# EAGLE design MotorDriver_FourthEdition_prot (EAGLE 6.6.0)
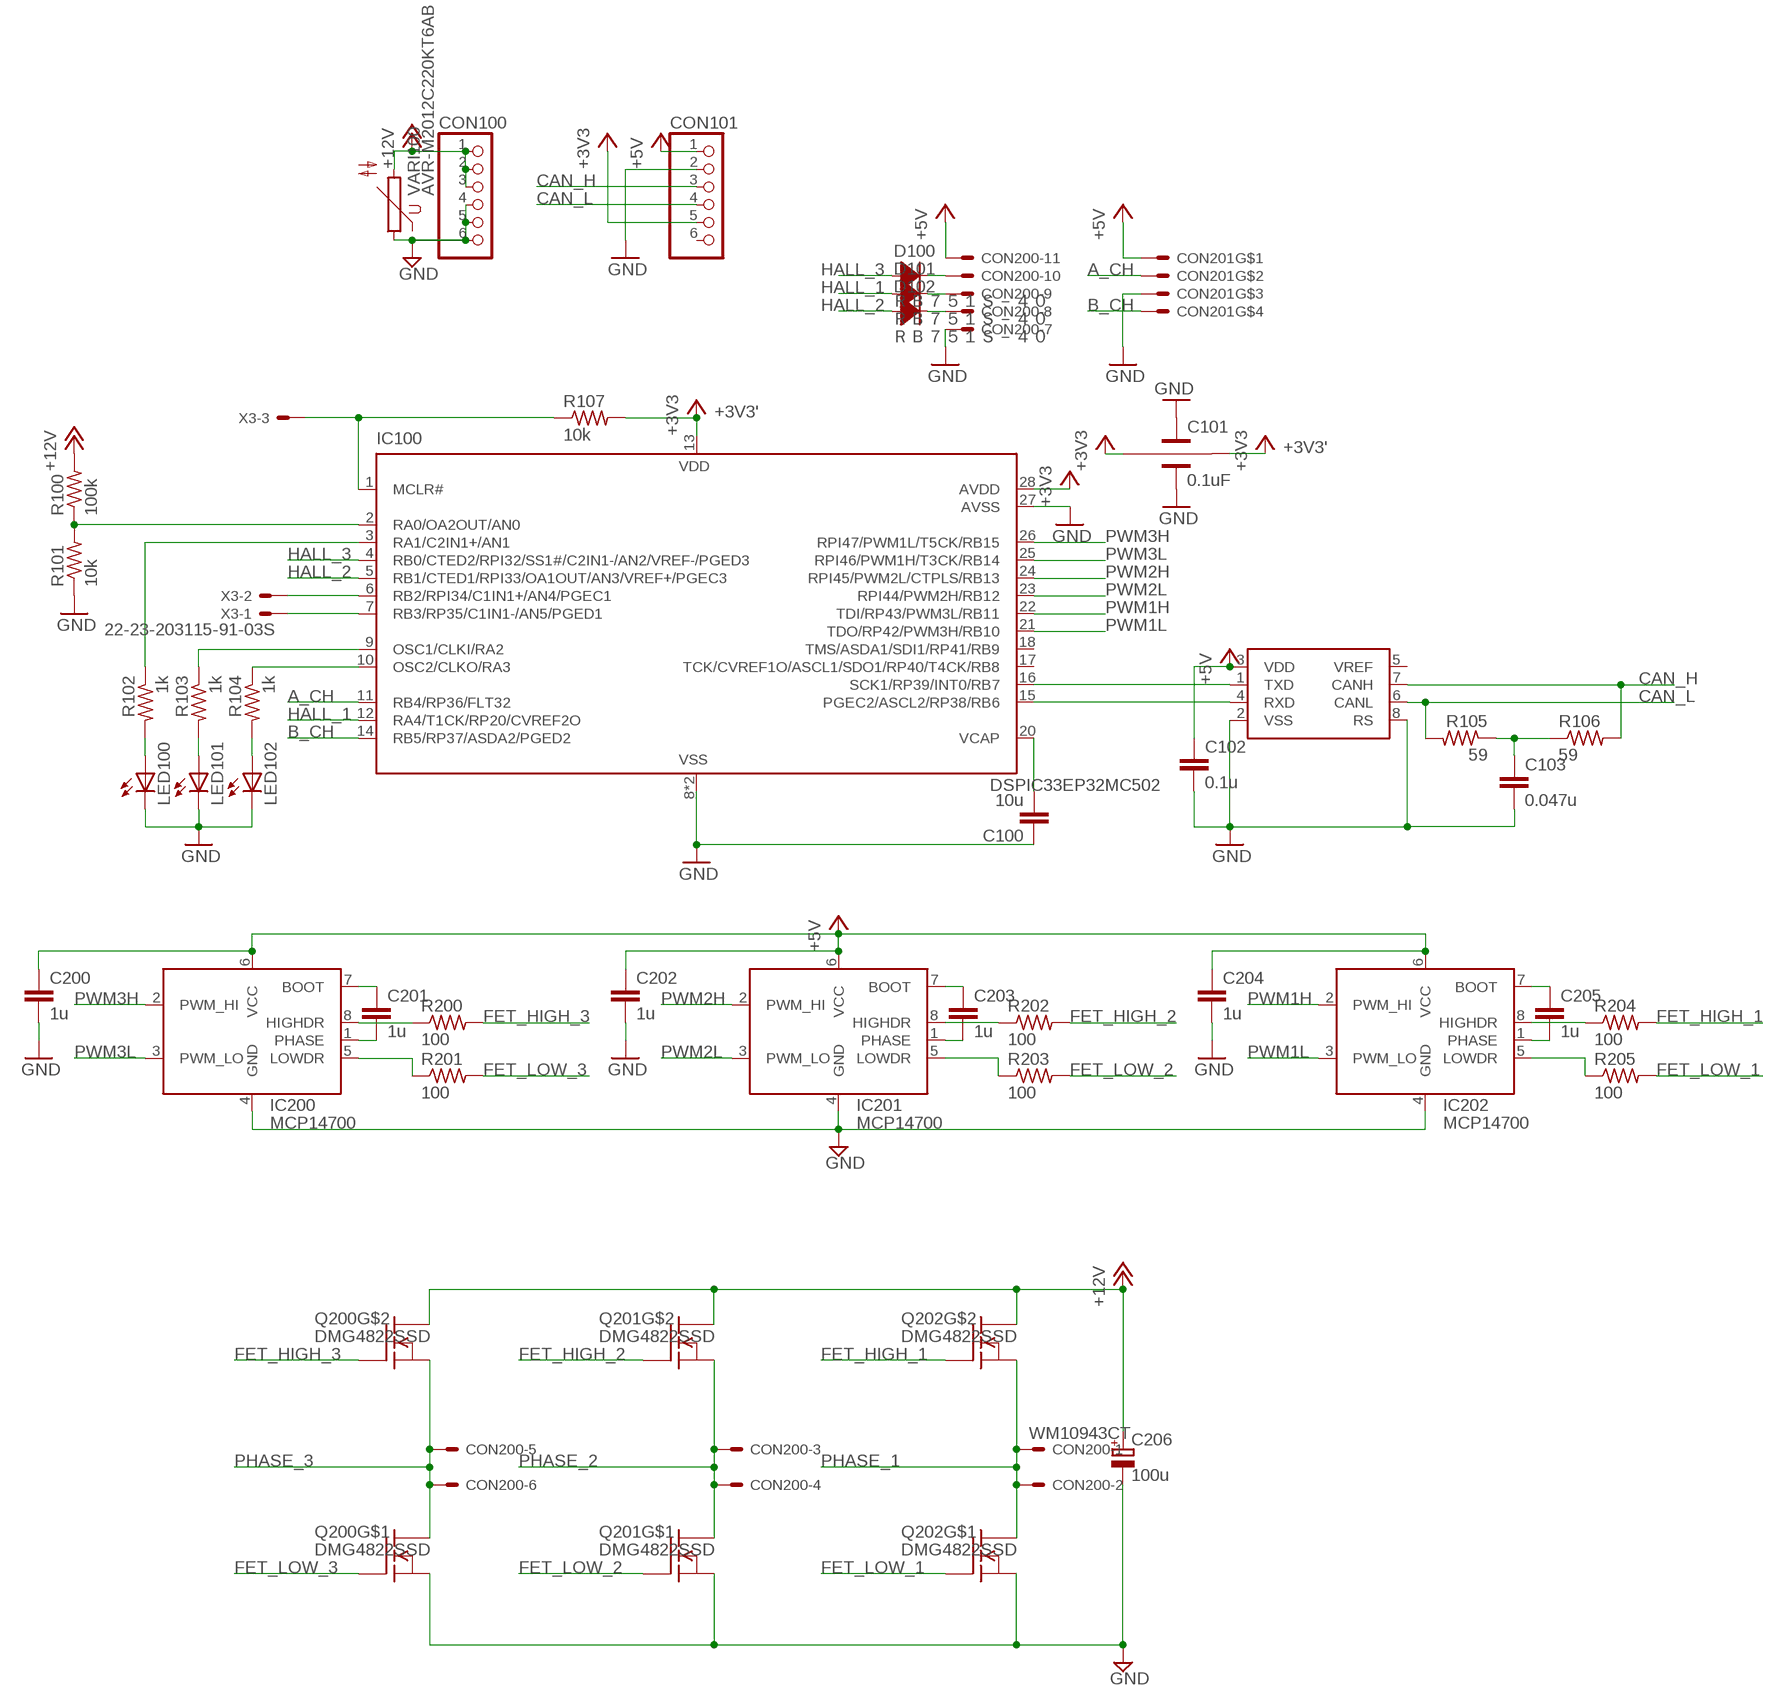
[diagram p0: schematic, sheet 1]

## Parts
C100  10u  CC2012  [C2012]
C101  0.1uF  CKD610JB  [CKD610JB]
C102  0.1u  CC1608  [C1608]
C103  0.047u  CC1608  [C1608]
C200  1u  CC1608  [C1608]
C201  1u  CC1608  [C1608]
C202  1u  CC1608  [C1608]
C203  1u  CC1608  [C1608]
C204  1u  CC1608  [C1608]
C205  1u  CC1608  [C1608]
C206  100u  CPOLE15-5RS  [E15-5RS]
CON100  PINHD-1X6S  [1X06S]
CON101  PINHD-1X6S  [1X06S]
CON200  WM10943CT  52207-1185  [52207-1185]
CON201  4B-XH-AS4B  [S4B-XH-A]
D100  ＲＢ７５１Ｓ－４０  DIODE1SS405  [1608]
D101  ＲＢ７５１Ｓ－４０  DIODE1SS405  [1608]
D102  ＲＢ７５１Ｓ－４０  DIODE1SS405  [1608]
IC100  DSPIC33EP32MC502  [SOIC-28]
IC101  MCP2551  [SOIC-8]
IC200  MCP14700  [SOIC-8]
IC201  MCP14700  [SOIC-8]
IC202  MCP14700  [SOIC-8]
LED100  LEDCHIPLED_0805  [CHIPLED_0805]
LED101  LEDCHIPLED_0805  [CHIPLED_0805]
LED102  LEDCHIPLED_0805  [CHIPLED_0805]
Q200  DMG4822SSD  [SO-8]
Q201  DMG4822SSD  [SO-8]
Q202  DMG4822SSD  [SO-8]
R100  100k  R-US_R1608  [R1608]
R101  10k  R-US_R1608  [R1608]
R102  1k  R-US_R1608  [R1608]
R103  1k  R-US_R1608  [R1608]
R104  1k  R-US_R1608  [R1608]
R105  59  R-US_R1608  [R1608]
R106  59  R-US_R1608  [R1608]
R107  10k  R-US_R1608  [R1608]
R200  100  R-US_R1608  [R1608]
R201  100  R-US_R1608  [R1608]
R202  100  R-US_R1608  [R1608]
R203  100  R-US_R1608  [R1608]
R204  100  R-US_R1608  [R1608]
R205  100  R-US_R1608  [R1608]
VARI100  AVR-M2012C220KT6AB  VARISTOR  [CT/CN0603]
X3  22-23-203115-91-03S  [15-91-03S]

## Nets
+3V3: C101.2(IN) CON101.5
+3V3': C101.1(OUT) IC100.13(VDD) IC100.28(AVDD) R107.2 ; supply symbol labelled +3V3
+5V: C102.1 C200.1 C202.1 C204.1 CON101.1 CON200.11 CON201.1 IC101.3(VDD) IC200.6(VCC) IC201.6(VCC) IC202.6(VCC)
+12V: C206.+ CON100.1 CON100.2 CON100.3 Q200.7(D) Q200.8(D) Q201.7(D) Q201.8(D) Q202.7(D) Q202.8(D) R100.2 VARI100.2
A_CH: CON201.2 IC100.11(RB4/RP36/FLT32)
AGND: C100.1 C101.3(GND) C101.4(GND1) C102.2 C103.2 CON101.2 CON200.7 CON201.3 IC100.8(VSS) IC100.19(VSS) IC100.27(AVSS) IC101.2(VSS) IC101.8(RS) LED100.C LED101.C LED102.C R101.1 ; supply symbol labelled GND
B_CH: CON201.4 IC100.14(RB5/RP37/ASDA2/PGED2)
CAN_H: CON101.3 IC101.7(CANH) R106.2
CAN_L: CON101.4 IC101.6(CANL) R105.2
FET_HIGH_1: Q202.2(G) R204.2
FET_HIGH_2: Q201.2(G) R202.2
FET_HIGH_3: Q200.2(G) R200.2
FET_LOW_1: Q202.4(G) R205.2
FET_LOW_2: Q201.4(G) R203.2
FET_LOW_3: Q200.4(G) R201.2
HALL_1: D101.A IC100.12(RA4/T1CK/RP20/CVREF2O)
HALL_2: D102.A IC100.5(RB1/CTED1/RPI33/OA1OUT/AN3/VREF+/PGEC3)
HALL_3: D100.A IC100.4(RB0/CTED2/RPI32/SS1#/C2IN1-/AN2/VREF-/PGED3)
N$1: IC100.1(MCLR#) R107.1 X3.3
N$2: C201.1 IC200.7(BOOT)
N$3: IC100.3(RA1/C2IN1+/AN1) R102.1
N$4: C203.1 IC201.7(BOOT)
N$5: IC100.7(RB3/RP35/C1IN1-/AN5/PGED1) X3.1
N$6: IC100.2(RA0/OA2OUT/AN0) R100.1 R101.2
N$7: C205.1 IC202.7(BOOT)
N$8: IC100.6(RB2/RPI34/C1IN1+/AN4/PGEC1) X3.2
N$9: C103.1 R105.1 R106.1
N$10: CON200.10 D100.C
N$11: CON200.9 D101.C
N$12: CON200.8 D102.C
N$13: IC100.16(SCK1/RP39/INT0/RB7) IC101.1(TXD)
N$14: IC100.15(PGEC2/ASCL2/RP38/RB6) IC101.4(RXD)
N$15: IC200.8(HIGHDR) R200.1
N$16: IC200.5(LOWDR) R201.1
N$17: IC201.8(HIGHDR) R202.1
N$18: IC201.5(LOWDR) R203.1
N$19: IC100.9(OSC1/CLKI/RA2) R103.1
N$20: LED100.A R102.2
N$21: IC202.8(HIGHDR) R204.1
N$22: IC202.5(LOWDR) R205.1
N$23: IC100.10(OSC2/CLKO/RA3) R104.1
N$24: C100.2 IC100.20(VCAP)
N$25: LED101.A R103.2
N$26: LED102.A R104.2
PGND: C200.2 C202.2 C204.2 C206.- CON100.4 CON100.5 CON100.6 IC200.4(GND) IC201.4(GND) IC202.4(GND) Q200.3(S) Q201.3(S) Q202.3(S) VARI100.1 ; supply symbol labelled GND
PHASE_1: C205.2 CON200.1 CON200.2 IC202.1(PHASE) Q202.1(S) Q202.5(D) Q202.6(D)
PHASE_2: C203.2 CON200.3 CON200.4 IC201.1(PHASE) Q201.1(S) Q201.5(D) Q201.6(D)
PHASE_3: C201.2 CON200.5 CON200.6 IC200.1(PHASE) Q200.1(S) Q200.5(D) Q200.6(D)
PWM1H: IC100.22(TDI/RP43/PWM3L/RB11) IC202.2(PWM_HI)
PWM1L: IC100.21(TDO/RP42/PWM3H/RB10) IC202.3(PWM_LO)
PWM2H: IC100.24(RPI45/PWM2L/CTPLS/RB13) IC201.2(PWM_HI)
PWM2L: IC100.23(RPI44/PWM2H/RB12) IC201.3(PWM_LO)
PWM3H: IC100.26(RPI47/PWM1L/T5CK/RB15) IC200.2(PWM_HI)
PWM3L: IC100.25(RPI46/PWM1H/T3CK/RB14) IC200.3(PWM_LO)
Unconnected: CON101.6 IC100.17(TCK/CVREF1O/ASCL1/SDO1/RP40/T4CK/RB8) IC100.18(TMS/ASDA1/SDI1/RP41/RB9) IC101.5(VREF)

## Library data of the parts
C100 C102 C103 C200-C205 = capacitor:C: CAPACITOR naming: grid - package width
C101 = EMI Filterlbr:CKD610JB
C206 = CPOL:CPOL
CON100 CON101 = pinhead:PINHD-1X6: PIN HEADER
CON200 = Con-SMT FFCFPC:52207-1185: FFC/FPC-to-Board 0.50mm (.020") SMT Top Contact Right Angle, ZIF, Style Receptacle 52745 / 52435 Source: http://www.molex.com/product/ffc/52745.html
CON201 = Con-JST:*4B-XH-A
D100-D102 = diode:DIODE: DIODE
IC100 = dsPIC:DSPIC33EP32MC502
IC101 = CAN:MCP2551
IC200-IC202 = GateDriver:MCP14700
LED100-LED102 = LED:LED: LED OSRAM: - CHIPLED LG R971, LG N971, LY N971, LG Q971, LY Q971, LO R971, LY R971 LH N974, LH R974 LS Q976, LO Q976, LY Q976 LO Q996 - Hyper CHIPLED LW Q18S LB Q993, LB Q99A, LB R99A - SideLED LS A670, LO A670, LY A670, LG A670, LP A670 LB A673, LV A673, LT A673, LW A673 LH A674 LY A675 LS A676, LA A676, LO A676, LY A676, LW A676 LS A679, LY A679, LG A679 - Hyper Micro SIDELED® LS Y876, LA Y876, LO Y876, LY Y876 LT Y87S - SmartLED LW L88C, LW L88S LB L89C, LB L89S, LG L890 LS L89K, LO L89K, LY L89K LS L896, LA L896, LO L896, LY L896 - TOPLED LS T670, LO T670, LY T670, LG T670, LP T670 LSG T670, LSP T670, LSY T670, LOP T670, LYG T670 LG T671, LOG T671, LSG T671 LB T673, LV T673, LT T673, LW T673 LH T674 LS T676, LA T676, LO T676, LY T676, LB T676, LH T676, LSB T676, LW T676 LB T67C, LV T67C, LT T67C, LS T67K, LO T67K, LY T67K, LW E67C LS E67B, LA E67B, LO E67B, LY E67B, LB E67C, LV E67C, LT E67C LW T67C LS T679, LY T679, LG T679 LS T770, LO T770, LY T770, LG T770, LP T770 LB T773, LV T773, LT T773, LW T773 LH T774 LS E675, LA E675, LY E675, LS T675 LS T776, LA T776, LO T776, LY T776, LB T776 LHGB T686 LT T68C, LB T68C - Hyper Mini TOPLED® LB M676 - Mini TOPLED Santana® LG M470 LS M47K, LO M47K, LY M47K Source: http://www.osram.convergy.de/
Q200-Q202 = DualN-ChannelFet:DMG4822SSD
R100-R107 R200-R205 = registor:R-US_: RESISTOR, American symbol
VARI100 = Varistor:VARISTOR: VARISTOR
X3 = con-molex:22-23-2031: .100" (2.54mm) Center Header - 3 Pin

## Board
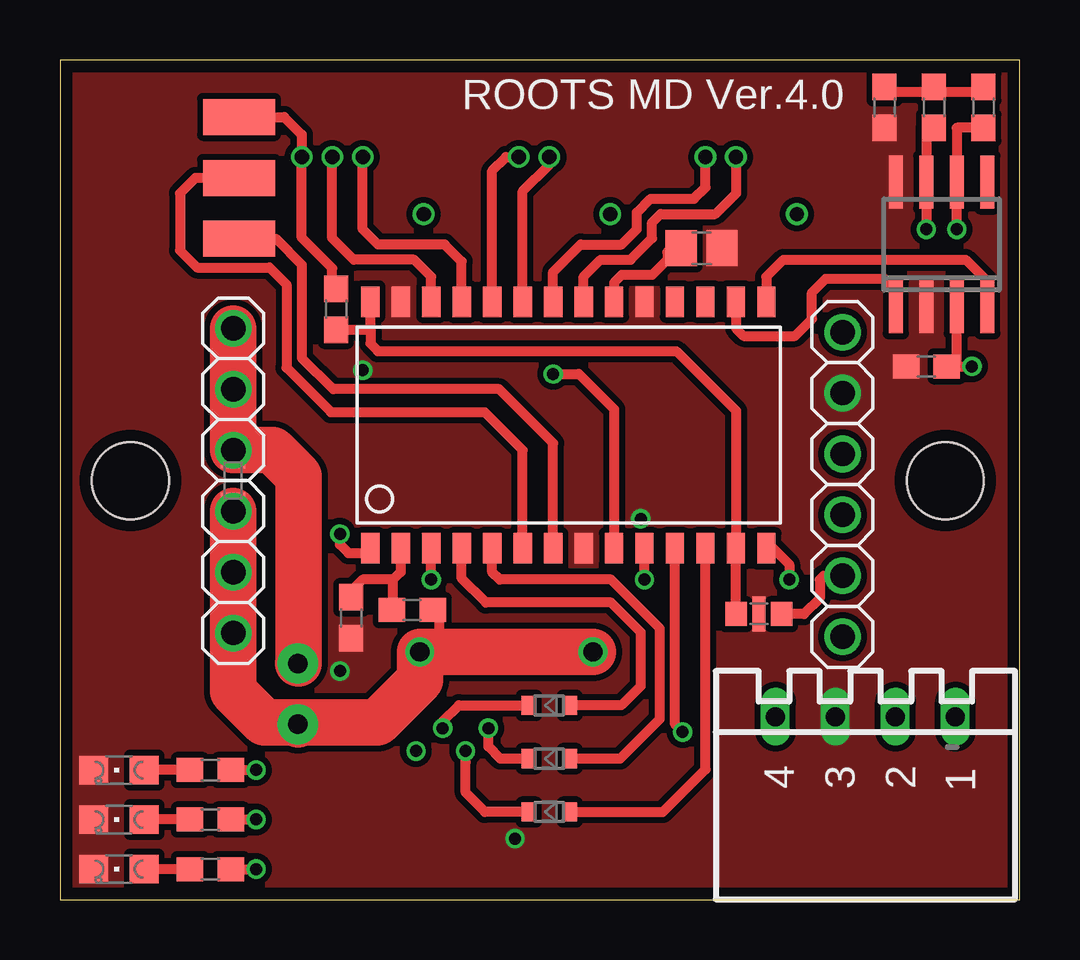
[diagram p1: board, top side]
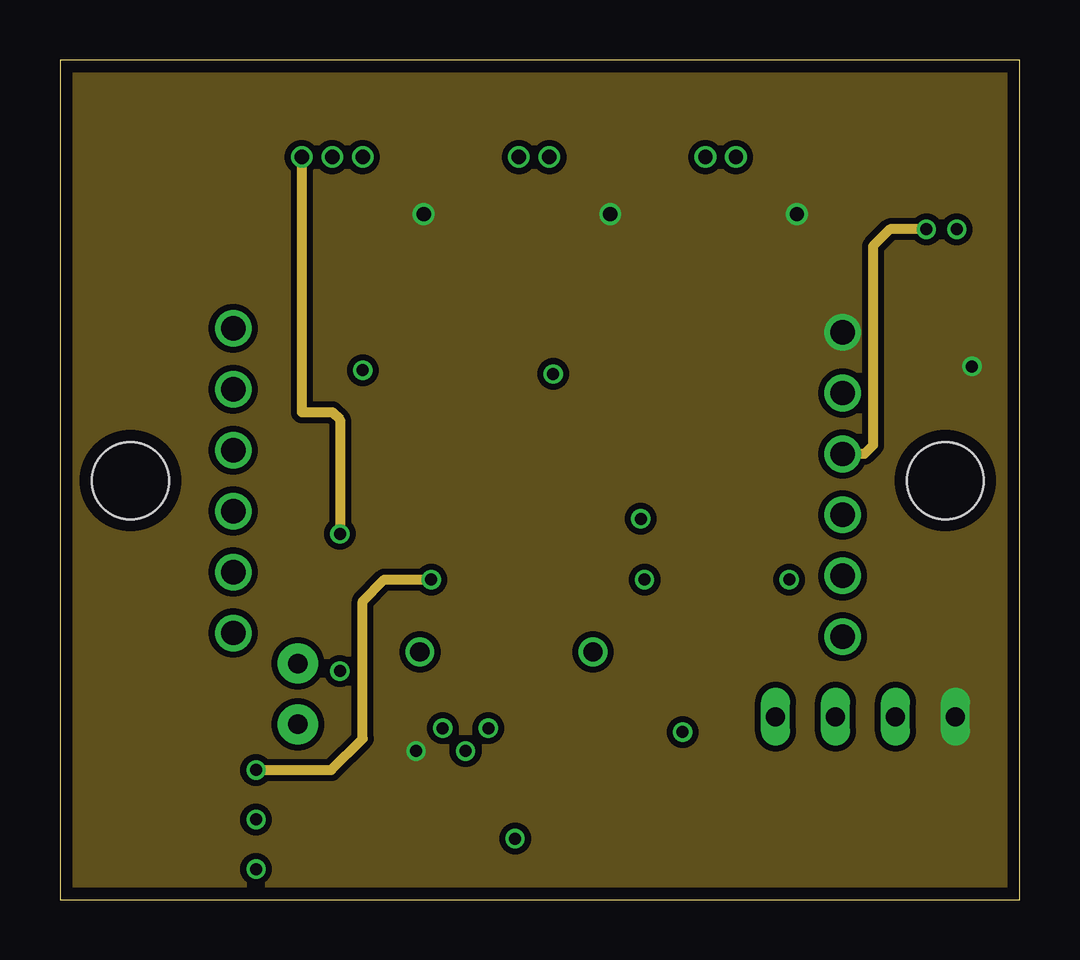
[diagram p2: board, inner layer +5V]
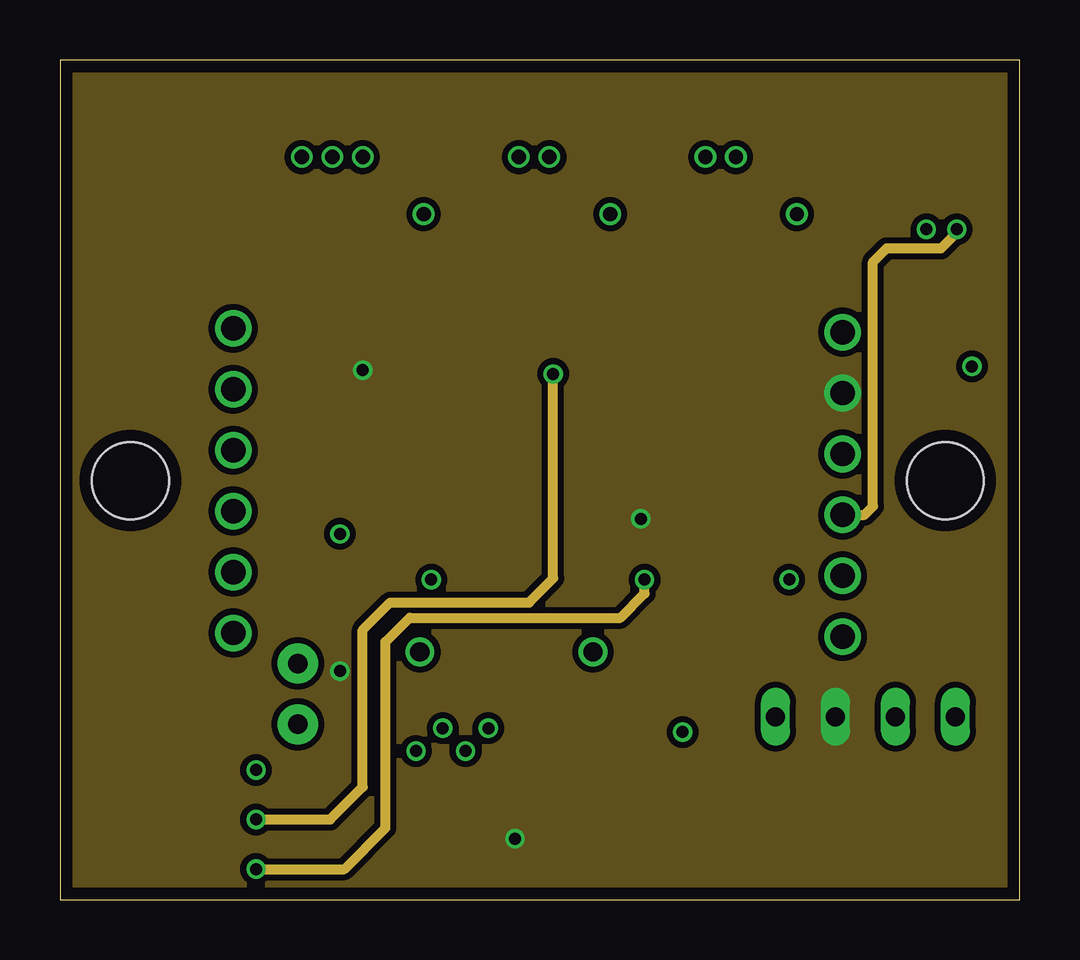
[diagram p3: board, inner layer AGND]
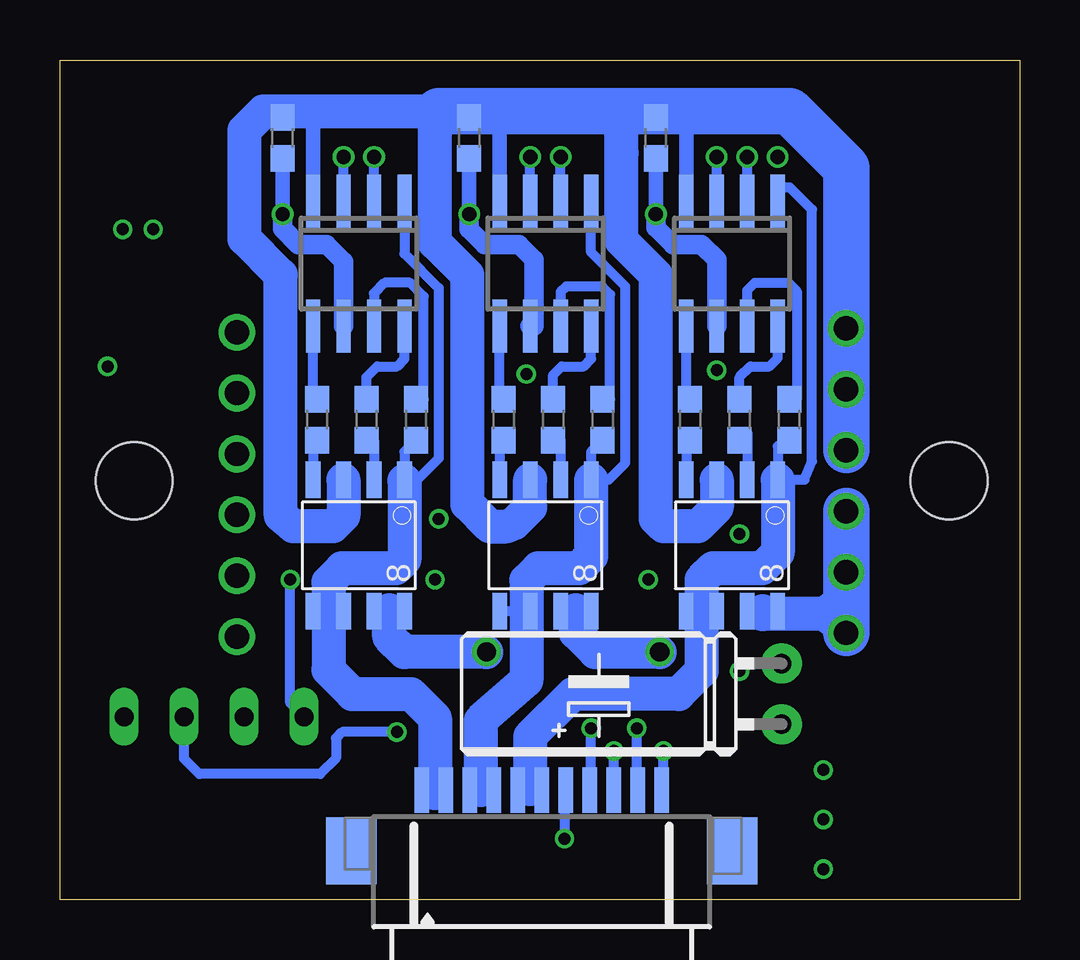
[diagram p4: board, bottom side, seen from below]

Size 40 x 35 mm. Coordinates in mm from the lower left corner, seen from the top.
Outline: 0,0 40,0 40,35 0,35 0,0
Copper layers (1*2*15*16): Top 0.035mm / dielectric 0.2mm / +5V 0.035mm / dielectric 1.2mm / AGND 0.035mm / dielectric 0.2mm / Bottom 0.035mm
Design rules "Elecrow_4-layer_PCB_eagle_rule": minimum track width 6mil, minimum drill 12mil, track to track 6mil, track to pad 6mil, pad to pad 6mil, via to via 8mil, smd to smd 0mil, copper to edge 20mil, drill to drill 10mil, minimum pad ring 6mil, minimum via ring 6mil, stop-mask expansion 0mil, vias tented up to drill 100mil, thermal gap 10mil
Holes 3.2 mm at 36.91,17.46 2.94,17.46

### Footprints (pad centres in the part's own frame; a part is rotated, then mirrored left to right if it is on the bottom)
C2012 = smd 1.3 x 1.5: 1 -0.85,0; 2 0.85,0
CKD610JB = smd 0.9 x 1: 1 -0.95,0; 2 0.95,0 | smd 0.55 x 0.725: 3 0,0.362; 4 0,-0.362
C1608 = smd 1.1 x 1: 1 -0.85,0; 2 0.85,0
E15-5RS = drill 0.813 pad 1.676: + 7.62,1.27; - 7.62,-1.27
1X06S = drill 1.016: 1 -6.35,0; 2 -3.81,0; 3 -1.27,0; 4 1.27,0; 5 3.81,0; 6 6.35,0
52207-1185 = smd 0.6 x 1.9: 1 -5,2.5; 2 -4,2.5; 3 -3,2.5; 4 -2,2.5; 5 -1,2.5; 6 0,2.5; 7 1,2.5; 8 2,2.5; 9 3,2.5; 10 4,2.5; 11 5,2.5 | smd 2.1 x 2.8: P$1 -7.93,-0.03; P$4 7.945,-0.03
S4B-XH-A = drill 0.8 long: 1 3.75,0; 2 1.25,0; 3 -1.25,0; 4 -3.75,0
1608 = smd 0.6 x 0.8: A 0.85,0; C -0.85,0
SOIC-28 = smd 0.762 x 1.27: 1 -7.62,-5.207; 2 -6.35,-5.207; 3 -5.08,-5.207; 4 -3.81,-5.207; 5 -2.54,-5.207; 6 -1.27,-5.207; 7 0,-5.207; 8 1.27,-5.207; 9 2.54,-5.207; 10 3.81,-5.207; 11 5.08,-5.207; 12 6.35,-5.207; 13 7.62,-5.207; 14 8.89,-5.207; 15 8.89,5.08; 16 7.62,5.08; 17 6.35,5.08; 18 5.08,5.08; 19 3.81,5.08; 20 2.54,5.08; 21 1.27,5.08; 22 0,5.08; 23 -1.27,5.08; 24 -2.54,5.08; 25 -3.81,5.08; 26 -5.08,5.08; 27 -6.35,5.08; 28 -7.62,5.08
SOIC-8 = smd 0.6 x 2.2: 1 -1.905,-2.6; 2 -0.635,-2.6; 3 0.635,-2.6; 4 1.905,-2.6; 5 1.905,2.6; 6 0.635,2.6; 7 -0.635,2.6; 8 -1.905,2.6
CHIPLED_0805 = smd 1.2 x 1.2: A 0,-1.05; C 0,1.05
SO-8 = smd 1.524 x 0.61: 1 -2.743,1.27; 2 -2.743,0; 3 -2.743,-1.27; 4 -2.743,-2.54; 5 2.743,-2.54; 6 2.743,-1.27; 7 2.743,0; 8 2.743,1.27
R1608 = smd 1.1 x 1: 1 -0.85,0; 2 0.85,0
CT/CN0603 = smd 1 x 1: 1 -1,0; 2 1,0
15-91-03S = smd 1.5 x 3: 1 -2.54,-0.635; 2 0,-0.635; 3 2.54,-0.635

### Placement (x,y rotation side)
C100  26.75,27.15 180 top
C101  29.13,11.91 0 top
C102  36.12,22.23 180 top
C103  34.37,33.02 270 top
C200  15.16,31.75 90 bottom
C201  9.6,20 270 bottom
C202  22.94,31.75 90 bottom
C203  17.38,20 270 bottom
C204  30.72,31.75 90 bottom
C205  25.16,20 270 bottom
C206  17.54,8.57 180 top
CON100  7.22,17.46 90 top
CON101  32.62,17.3 270 top
CON200  19.92,2.06 0 bottom
CON201  33.58,7.62 0 top
D100  20.4,8.1 0 top
D101  20.4,3.65 0 top
D102  20.4,5.87 0 top
IC100  20.56,19.84 0 top
IC101  36.75,27.3 0 top
IC200  11.98,26.51 180 bottom
IC201  19.76,26.51 180 bottom
IC202  27.54,26.51 180 bottom
LED100  2.46,5.4 90 top
LED101  2.46,3.33 90 top
LED102  2.46,1.27 90 top
Q200  11.35,14.76 270 bottom
Q201  19.13,14.76 270 bottom
Q202  26.91,14.76 270 bottom
R100  14.68,12.06 0 top
R101  12.14,11.75 90 top
R102  6.27,5.4 180 top
R103  6.27,3.33 180 top
R104  6.27,1.27 180 top
R105  38.5,33.02 270 top
R106  36.43,33.02 270 top
R107  11.51,24.61 270 top
R200  11.67,20 270 bottom
R201  13.73,20 270 bottom
R202  19.45,20 270 bottom
R203  21.51,20 270 bottom
R204  27.23,20 270 bottom
R205  29.29,20 270 bottom
VARI100  7.22,17.46 270 top
X3  6.83,30.08 90 top

### Tracks (layer width: path | path; a pad name or v marks a point on that pad's centre or on a via)
+3V3
  Top 0.406: C101.2 31.02,11.91 31.67,12.56 31.67,13.34 31.83,13.49 CON101.5
+3V3'
  Top 0.406: R107.2 12.94,23.76 | 12.94,23.76 12.94,23.18 13.26,22.86 25.7,22.86 28.18,20.38 IC100.13 C101.1 | 12.94,23.76 IC100.28
+5V  (via drill 0.5, 0.6)
  Top 0.406: IC101.3 37.39,22.23 C102.1 v38.02,22.23
  Bottom 0.406: 15,4.41 CON200.11 14.84,4.41 v14.84,6.19
  Bottom 0.61: v30.72,28.57 C204.1 | C202.1 v22.94,28.57 | C200.1 v15.16,28.57
  Bottom 0.813: IC200.6 12.62,26.67 13.26,27.3 14.45,27.3 15.16,28.02 v15.16,28.57 | IC201.6 20.24,23.91 20.24,26.67 20.88,27.3 22.3,27.3 22.94,27.94 v22.94,28.57 | IC202.6 28.18,26.59 28.89,27.3 30.06,27.3 30.72,27.96 v30.72,28.57
  pour +5V (isolate 0.254, no thermals): 0,35 40,35 40,0 0,0
+12V  (via drill 0.8)
  Top 0.406: CON100.3 VARI100.2 | 18.34,11.06 18.34,10.32 | R100.2 15.79,12.38 15.79,10.32
  Top 1.93: v22.22,10.32 18.34,10.32 15.79,10.32 v15,10.32 15,9.15 13.24,7.39 9.92,7.39 | CON100.3 7.22,8.68 8.51,7.39 9.92,7.39 | 9.92,7.39 C206.+
  Bottom 0.406: 10.71,12.02 Q200.8 | Q200.7 10.71,12.02 | 10.71,12.02 10.71,12.06 | Q201.8 18.7,11.91 | 18.7,11.91 18.49,12.06 | Q201.7 18.7,11.91 | Q202.8 26.27,12.02 | 26.27,12.02 26.27,12.06 | Q202.7 26.27,12.02
  Bottom 1.422: 7.7,11.91 10.71,11.91 10.71,12.02 | v22.22,10.32 25.64,10.32 26.27,10.95 26.27,12.06 | v15,10.32 17.68,10.32 18.49,11.13 18.49,12.06
  Bottom 1.93: 7.7,11.91 7.22,11.91 CON100.1 CON100.2 CON100.3
A_CH  (via drill 0.5)
  Top 0.406: v25.96,6.99 25.64,7.3 IC100.11
  Bottom 0.406: v25.96,6.99 28.23,6.99 28.5,6.72 28.5,5.89 29.15,5.24 34.19,5.24 34.83,5.87 CON201.2
AGND  (via drill 0.5)
  Bottom 0.406: CON200.7 18.97,4.41 v18.97,2.54
  other vias: 11.67,9.53 12.62,22.07 24.21,15.88
  pour Top (isolate 0.254, no thermals): 0,35 40,35 40,0 0,0
  pour AGND (isolate 0.254, no thermals): 0,35 40,35 40,0 0,0
B_CH  (via drill 0.5)
  Top 0.406: v30.4,13.34 30.4,13.97 29.73,14.64 IC100.14
  Bottom 0.406: CON201.4 30.4,8.2 v30.4,13.34
CAN_H  (via drill 0.5)
  Top 0.406: R106.2 36.12,32.17 IC101.7 v36.12,27.94
  +5V 0.406: v36.12,27.94 34.6,27.94 33.89,27.23 33.89,18.93 33.54,18.57 CON101.3
CAN_L  (via drill 0.5)
  Top 0.406: R105.2 37.39,32.17 IC101.6 v37.39,27.94
  AGND 0.406: CON101.4 33.54,16.03 33.89,16.39 33.89,26.57 34.47,27.15 36.73,27.15 37.39,27.8 v37.39,27.94
FET_HIGH_1
  Bottom 0.406: R204.2 26.91,19.15 Q202.2
FET_HIGH_2
  Bottom 0.406: R202.2 19.13,19.15 Q201.2
FET_HIGH_3
  Bottom 0.406: R200.2 11.35,19.47 Q200.2
FET_LOW_1
  Bottom 0.406: R205.2 29.45,19.15 Q202.4
FET_LOW_2
  Bottom 0.406: R203.2 21.67,19.47 Q201.4
FET_LOW_3
  Bottom 0.406: R201.2 13.89,19.15 Q200.4
HALL_1
  Top 0.406: D101.A 25.13,3.65 26.91,5.43 IC100.12
HALL_2
  Top 0.406: D102.A 23.35,5.87 25,7.53 25,11.3 22.97,13.34 18.34,13.34 18.02,13.65 IC100.5
HALL_3
  Top 0.406: D100.A 23.4,8.1 24.21,8.91 24.21,11.14 22.97,12.38 17.75,12.38 16.75,13.39 IC100.4
N$1  (via drill 0.5, 0.6)
  Top 0.406: v11.67,15.24 11.67,14.8 12.02,14.45 12.94,14.45 IC100.1 | X3.3 9.35,32.62 10.08,31.89 v10.08,30.96 10.08,27.59 11.35,26.32 11.35,25.46 R107.1
  +5V 0.406: v10.08,30.96 10.08,20.32 11.35,20.32 11.67,20 v11.67,15.24
N$2
  Bottom 0.406: IC200.7 11.35,25.4 11.03,25.72 9.64,25.72 9.29,25.36 9.29,20.85 C201.1
N$3  (via drill 0.5)
  Top 0.406: R102.1 v8.18,5.4 | v15.48,13.34 IC100.3
  +5V 0.406: v8.18,5.4 11.31,5.4 12.62,6.71 12.62,12.44 13.52,13.34 v15.48,13.34
N$4
  Bottom 0.406: C203.1 17.07,20.85 17.07,25.22 17.4,25.56 18.9,25.56 19.13,25.33 IC201.7
N$5
  Top 0.406: IC100.7 20.56,19.03 18.31,21.27 11.39,21.27 10.08,22.58 10.08,26.46 9,27.54 X3.1
N$6
  Top 0.406: IC100.2 14.21,13.65 13.89,13.34 | 13.89,13.34 12.62,13.34 12.14,12.86 R101.2 | R100.1 13.89,12.06 13.89,13.34
N$7
  Bottom 0.406: C205.1 24.84,20.85 24.84,25.14 25.42,25.72 26.46,25.72 26.91,25.27 IC202.7
N$8
  Top 0.406: IC100.6 19.29,18.73 17.7,20.32 11.3,20.32 9.45,22.17 9.45,25.64 8.73,26.35 5.71,26.35 5,27.06 5,29.44 5.64,30.08 X3.2
N$9
  Top 0.406: R105.1 38.5,33.66 36.43,33.66 | 36.43,33.66 34.37,33.66 C103.1 | R106.1 36.43,33.66
N$10  (via drill 0.5)
  Top 0.406: v15.95,7.14 15.95,7.42 16.63,8.1 D100.C
  Bottom 0.406: CON200.10 15.95,4.56 v15.95,7.14
N$11  (via drill 0.5)
  Top 0.406: 16.91,5.73 v16.91,6.19 16.91,4.46 17.72,3.65 D101.C
  Bottom 0.406: v16.91,6.19 16.92,6.35 CON200.9
N$12  (via drill 0.5)
  Top 0.406: 17.86,7.01 v17.86,7.14 17.86,6.38 18.36,5.87 D102.C
  Bottom 0.406: CON200.8 17.86,5.2 v17.86,7.14
N$13
  Top 0.406: IC101.1 34.84,25.4 34.37,25.88 31.93,25.88 31.35,25.3 31.35,24.2 30.64,23.5 28.5,23.5 28.18,23.81 IC100.16
N$14
  Top 0.406: IC101.4 38.66,25.77 37.76,26.67 30.16,26.67 29.45,25.96 IC100.15
N$15
  Bottom 0.406: R200.1 11.67,21.78 11.22,22.23 10.44,22.23 10.08,22.58 IC200.8
N$16
  Bottom 0.406: R201.1 13.89,20.85 IC200.5
N$17
  Bottom 0.406: R202.1 19.45,21.87 19.09,22.23 18.18,22.23 17.86,22.54 IC201.8
N$18
  Bottom 0.406: R203.1 21.67,20.85 IC201.5
N$19  (via drill 0.5)
  Top 0.406: R103.1 v8.18,3.33 | v20.56,21.91 21.63,21.91 23.1,20.44 IC100.9
  AGND 0.406: v8.18,3.33 11.26,3.33 12.62,4.69 12.62,11.24 13.77,12.38 19.55,12.38 20.56,13.39 v20.56,21.91
N$20
  Top 0.406: R102.2 LED100.A
N$21
  Bottom 0.406: R204.1 27.23,21.78 26.78,22.23 25.96,22.23 25.64,22.54 IC202.8
N$22
  Bottom 0.406: R205.1 29.45,20.85 IC202.5
N$23  (via drill 0.5)
  Top 0.406: R104.1 v8.18,1.27 | v24.37,13.34 IC100.10
  AGND 0.406: v8.18,1.27 11.86,1.27 13.57,2.98 13.57,10.74 14.58,11.75 23.36,11.75 24.37,12.75 v24.37,13.34
N$24
  Top 0.406: C100.2 25.48,27.15 25.32,26.99 25.32,26.67 24.69,26.04 23.42,26.04 23.1,25.72 IC100.20
N$25
  Top 0.406: R103.2 LED101.A
N$26
  Top 0.406: R104.2 LED102.A
PGND
  Top 0.406: VARI100.1 CON100.4
  Top 1.93: CON100.6 CON100.4 8.86,18.73 9.94,17.66 9.94,9.84 C206.-
  Bottom 0.406: CON100.4 7.54,18.73 7.54,18.41
  Bottom 0.61: IC202.4 29.45,32.86 | C204.2 30.88,32.76 30.88,32.86 | IC201.4 21.67,32.86 | C202.2 22.94,32.86 | IC200.4 13.89,32.86 | C200.2 14.53,32.6 14.53,32.86
  Bottom 0.813: 16.43,30.96 16.59,31.11 | 24.21,32.86 24.21,30.96
  Bottom 1.422: Q200.3 12.62,16.35 13.41,15.56 14.84,15.56 15.16,15.88 15.16,26.04 16.59,27.46 16.59,31.11 16.59,32.86 | Q201.3 20.4,16.35 21.06,15.69 21.38,15.56 22.09,15.56 23.02,16.49 23.02,26.04 24.37,27.38 24.37,32.86 | Q202.3 28.18,16.01 28.63,15.56 30.27,15.56 30.8,16.01 30.8,26.04 32.3,27.54 32.3,32.07 31.51,32.86 30.88,32.86 29.45,32.86 24.37,32.86 | 24.37,32.86 24.21,32.86
  Bottom 1.93: 24.21,32.86 22.94,32.86 21.67,32.86 16.59,32.86 14.53,32.86 13.89,32.86 9.58,32.86 7.22,30.5 CON100.6 CON100.5 CON100.4
PHASE_1
  Bottom 0.406: C205.2 25.64,18.68 Q202.1 25.64,17.46 25.13,17.46 24.21,18.39 24.21,25.5 25.64,26.92 IC202.1 | CON200.1 CON200.2 24.37,5.2 24.37,4.45 | Q202.6 28.81,12.02 | Q202.5 28.81,12.02 | 28.81,12.02 28.81,12.06
  Bottom 1.422: 25.64,17.46 25.64,14.17 25.99,13.81 28.24,13.81 28.81,13.24 28.81,12.06 28.81,9.58 27.81,8.57 25.37,8.57 24.37,7.57 24.37,4.45
PHASE_2
  Bottom 0.406: C203.2 17.86,18.68 Q201.1 17.12,17.51 16.43,18.2 16.43,25.56 17.86,26.99 IC201.1 | Q201.5 Q201.6 21.03,12.02 20.56,12.06 | CON200.3 22.46,4.56 CON200.4
  Bottom 1.422: Q201.1 17.86,14.31 18.36,13.81 20.06,13.81 20.56,13.31 20.56,12.06 20.56,9.13 22.46,7.46 22.46,4.56
PHASE_3
  Bottom 0.406: C201.2 9.71,19.15 10.08,18.91 Q200.1 8.97,17.51 8.65,18.27 8.65,28.76 9.58,29.69 10.08,29.69 IC200.1 | CON200.5 20.4,5.36 CON200.6 | Q200.6 13.26,12.02 | Q200.5 13.26,12.02 | 13.26,12.02 13.26,12.06
  Bottom 1.422: Q200.1 10.08,14.47 10.73,13.81 12.78,13.81 13.26,13.34 13.26,12.06 13.26,9.53 14.21,8.57 18.62,8.57 20.4,6.8 20.4,5.36 20.4,4.6
PWM1H  (via drill 0.6)
  Top 0.406: v26.91,30.96 26.91,29.68 26.44,29.21 24.62,29.21 24.05,28.64 24.05,27.94 23.42,27.3 21.7,27.3 20.56,26.16 IC100.22
  Bottom 0.406: IC202.2 v26.91,30.96
PWM1L  (via drill 0.6)
  Top 0.406: v28.18,30.96 28.18,29.43 27.32,28.57 25.04,28.57 24.69,28.22 24.69,27.57 23.79,26.67 22.54,26.67 21.83,25.96 IC100.21
  Bottom 0.406: IC202.3 v28.18,30.96
PWM2H  (via drill 0.6)
  Top 0.406: v19.13,30.96 18.59,30.96 18.02,30.38 IC100.24
  Bottom 0.406: IC201.2 v19.13,30.96
PWM2L  (via drill 0.6)
  Top 0.406: v20.4,30.96 20.4,30.64 19.29,29.53 IC100.23
  Bottom 0.406: IC201.3 v20.4,30.96
PWM3H  (via drill 0.6)
  Top 0.406: v11.35,30.96 11.35,27.57 12.25,26.67 14.77,26.67 15.48,25.96 IC100.26
  Bottom 0.406: IC200.2 v11.35,30.96
PWM3L  (via drill 0.6)
  Top 0.406: v12.62,30.96 12.62,27.94 13.26,27.3 16.04,27.3 16.75,26.59 IC100.25
  Bottom 0.406: IC200.3 v12.62,30.96

### Text on the board
tPlace: ROOTS MD Ver.4.0